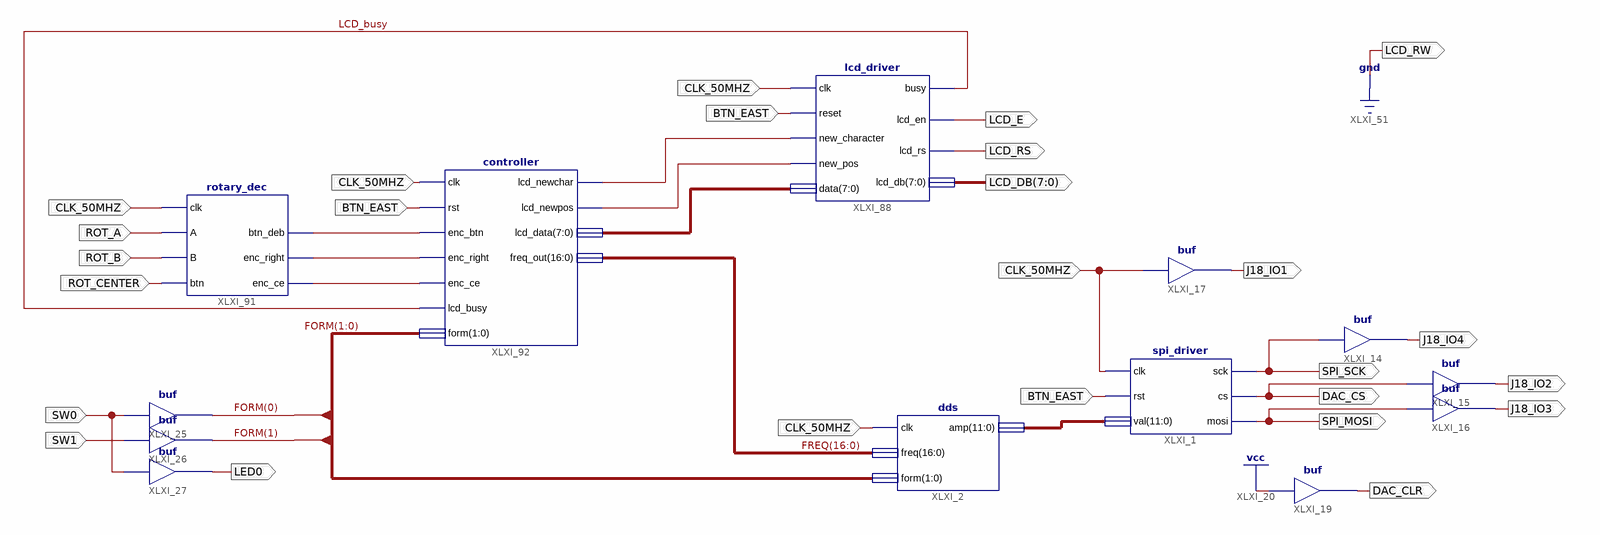
[diagram p0: schematic sheet 1]
// Xilinx ISE schematic toplevel.sch (spartan3a) as structural Verilog: 13 symbols, 20 ports
module toplevel (
  input  CLK_50MHZ,
  input  SW0,
  input  SW1,
  input  BTN_EAST,
  input  ROT_A,
  input  ROT_B,
  input  ROT_CENTER,
  output SPI_SCK,
  output DAC_CS,
  output SPI_MOSI,
  output J18_IO4,
  output J18_IO2,
  output J18_IO3,
  output J18_IO1,
  output LCD_RS,
  output LCD_E,
  output [7:0] LCD_DB,
  output LCD_RW,
  output DAC_CLR,
  output LED0
);

  wire LCD_busy, XLXN_77, XLXN_79, XLXN_176, XLXN_179, XLXN_181;
  wire [1:0] FORM;
  wire [7:0] XLXN_180;
  wire [11:0] XLXN_9;
  wire [16:0] FREQ;

  dds XLXI_2 (.clk(CLK_50MHZ), .freq(FREQ), .form(FORM), .amp(XLXN_9));
  spi_driver XLXI_1 (.clk(CLK_50MHZ), .rst(BTN_EAST), .val(XLXN_9), .sck(SPI_SCK), .cs(DAC_CS), .mosi(SPI_MOSI));
  buf XLXI_14 (J18_IO4, SPI_SCK);
  buf XLXI_15 (J18_IO2, DAC_CS);
  buf XLXI_16 (J18_IO3, SPI_MOSI);
  buf XLXI_17 (J18_IO1, CLK_50MHZ);
  lcd_driver XLXI_88 (
    .clk(CLK_50MHZ), .reset(BTN_EAST), .new_character(XLXN_176), .new_pos(XLXN_179), .data(XLXN_180),
    .busy(LCD_busy), .lcd_en(LCD_E), .lcd_rs(LCD_RS), .lcd_db(LCD_DB));
  buf XLXI_19 (DAC_CLR, 1'b1);
  buf XLXI_25 (FORM[0], SW0);
  buf XLXI_26 (FORM[1], SW1);
  buf XLXI_27 (LED0, SW0);
  rotary_dec XLXI_91 (
    .clk(CLK_50MHZ), .A(ROT_A), .B(ROT_B), .btn(ROT_CENTER), .enc_ce(XLXN_79), .enc_right(XLXN_77),
    .btn_deb(XLXN_181));
  controller XLXI_92 (
    .clk(CLK_50MHZ), .rst(BTN_EAST), .lcd_busy(LCD_busy), .form(FORM), .lcd_newchar(XLXN_176),
    .lcd_newpos(XLXN_179), .lcd_data(XLXN_180), .freq_out(FREQ), .enc_right(XLXN_77), .enc_ce(XLXN_79),
    .enc_btn(XLXN_181));

  assign LCD_RW = 1'b0;
endmodule
